# EAGLE design strobocops_v3 (EAGLE 8.7.1)
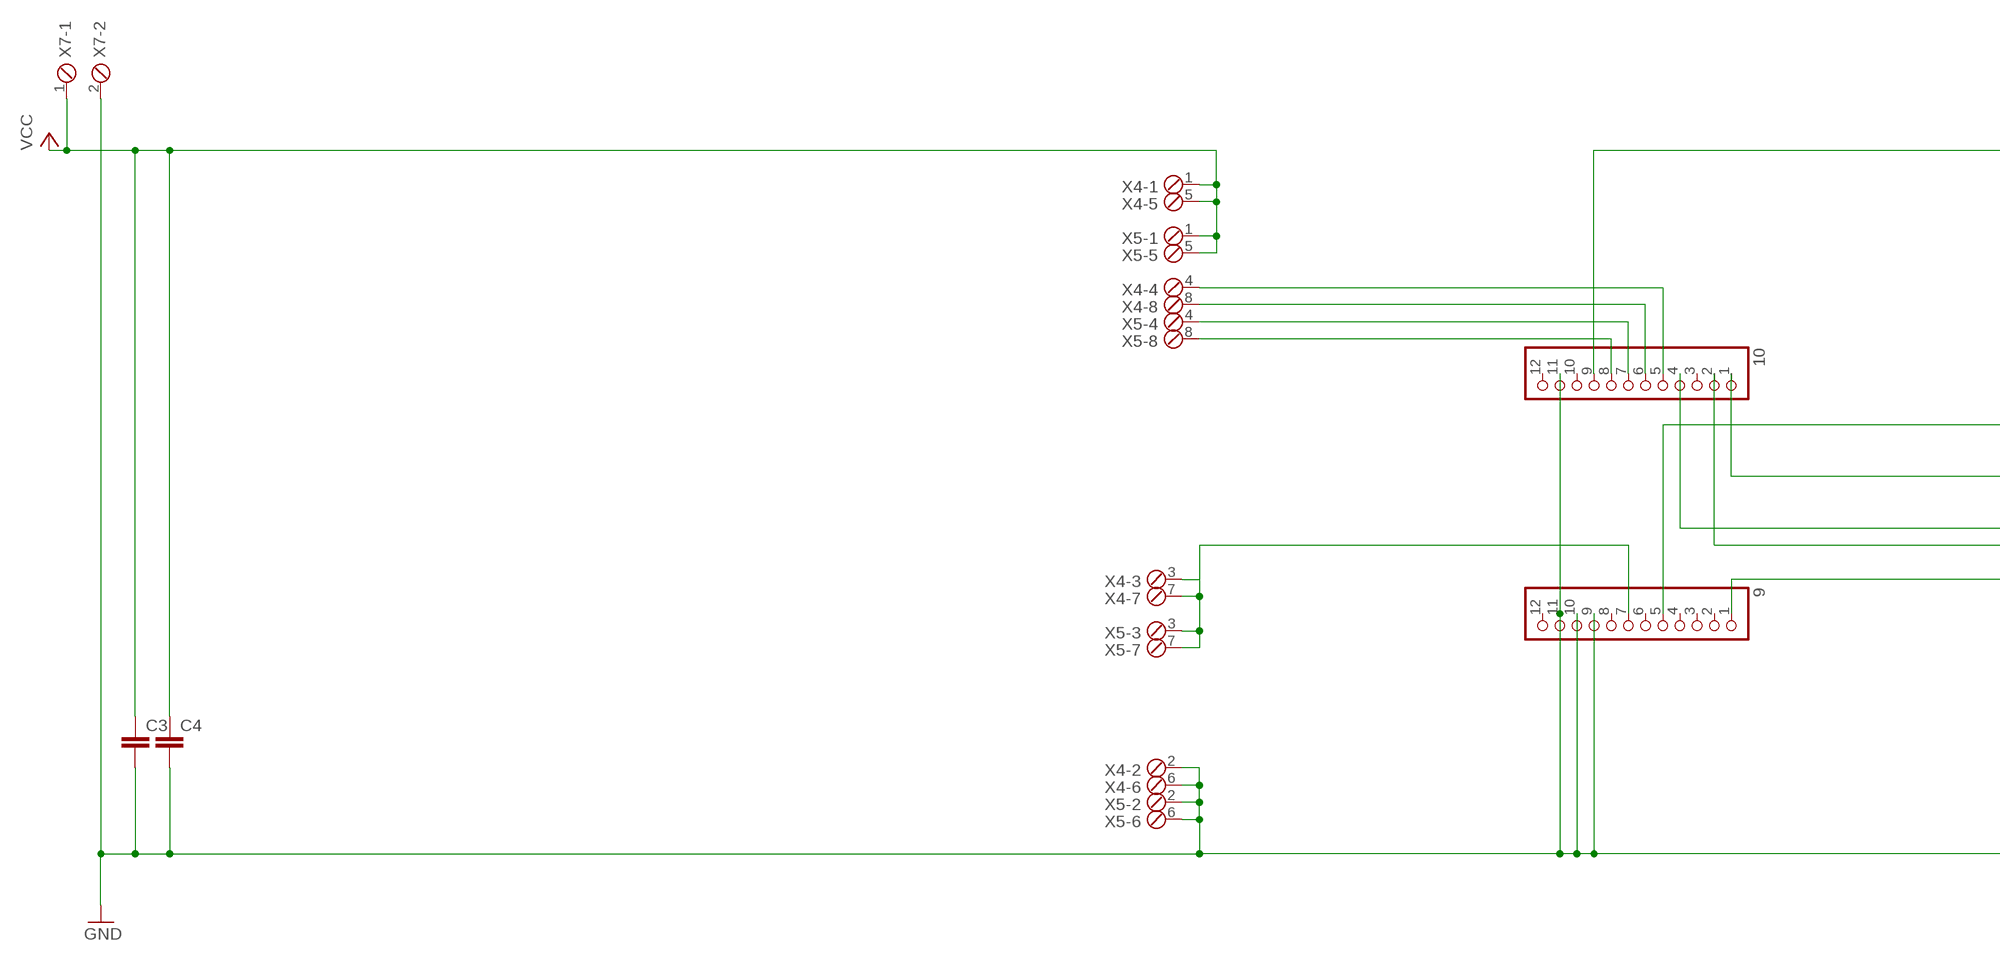
[diagram p0: schematic, sheet 1, part 1 of 2]
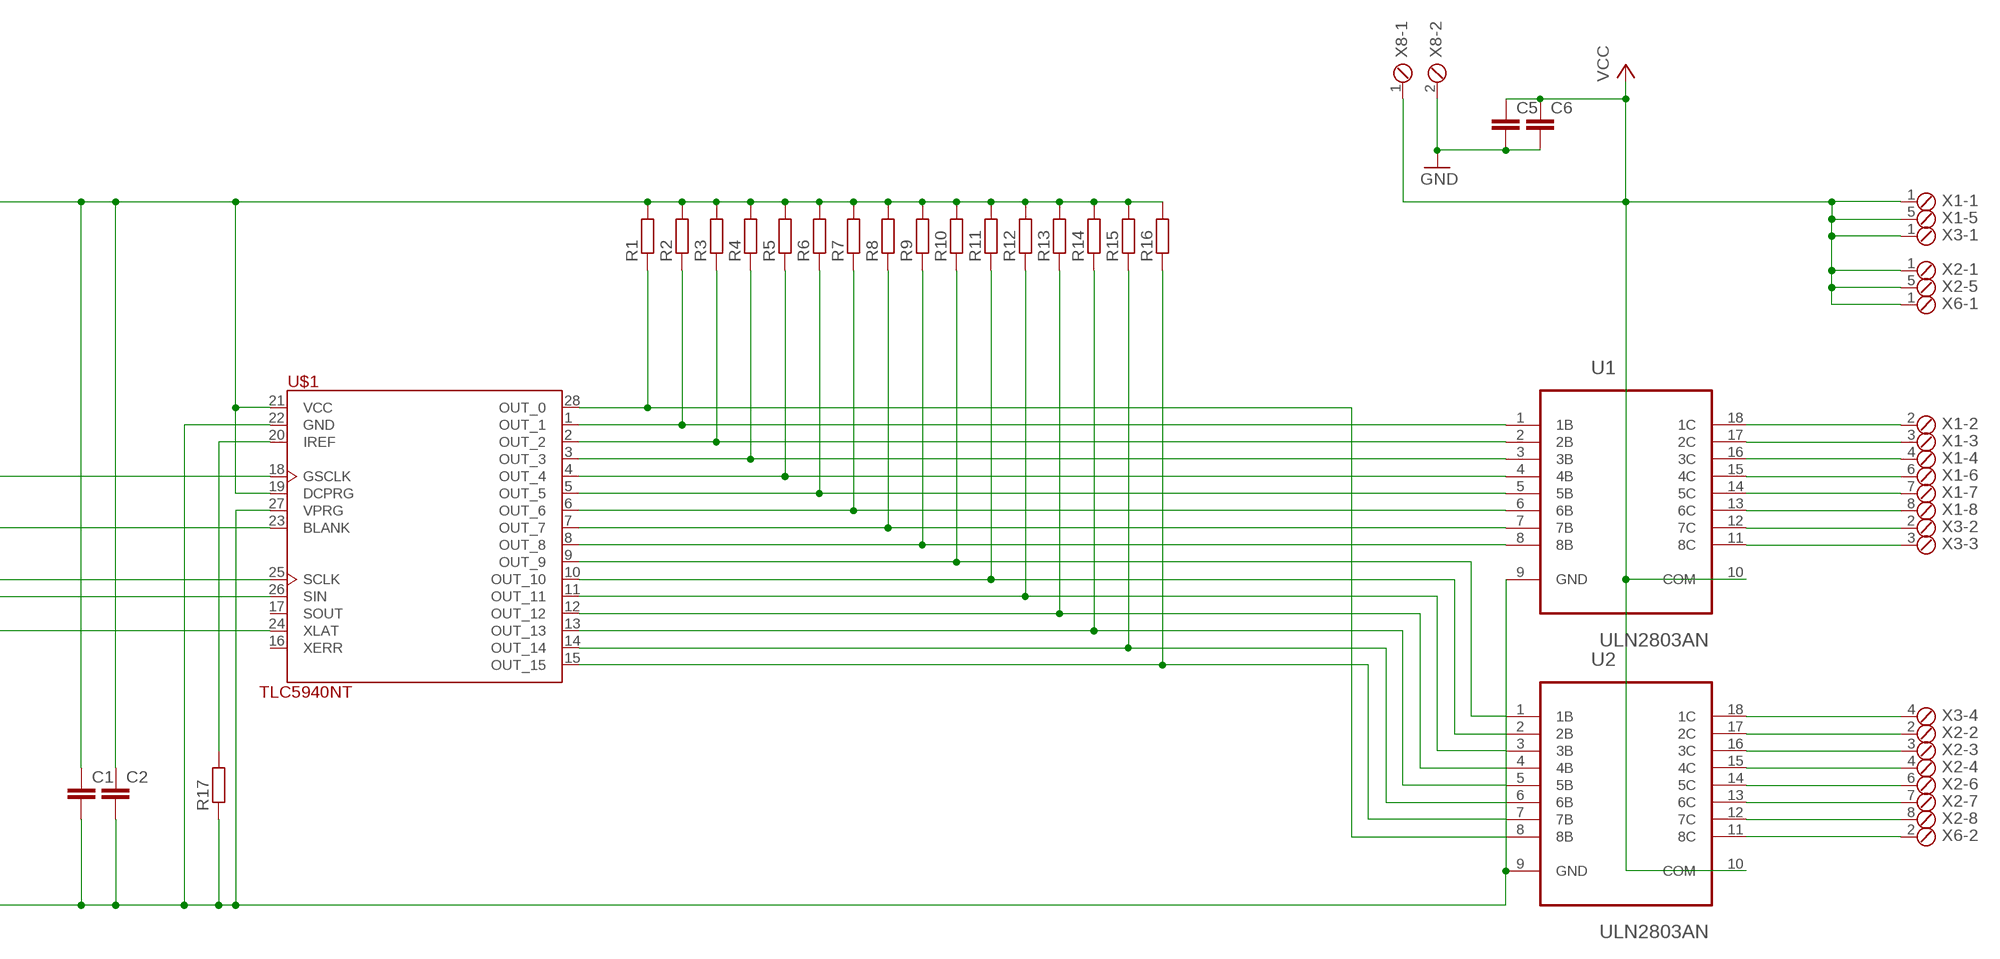
[diagram p1: schematic, sheet 1, part 2 of 2]

## Parts
9  PINHD-1X12-CB  [1X12-CB]
10  PINHD-1X12-CB  [1X12-CB]
C1  C-EU050-025X075  [C050-025X075]
C2  C-EU050-025X075  [C050-025X075]
C3  C-EU050-025X075  [C050-025X075]
C4  C-EU050-025X075  [C050-025X075]
C5  C-EU050-025X075  [C050-025X075]
C6  C-EU050-025X075  [C050-025X075]
R1  R-EU_0207/2V  [0207/2V]
R2  R-EU_0207/2V  [0207/2V]
R3  R-EU_0207/2V  [0207/2V]
R4  R-EU_0207/2V  [0207/2V]
R5  R-EU_0207/2V  [0207/2V]
R6  R-EU_0207/2V  [0207/2V]
R7  R-EU_0207/2V  [0207/2V]
R8  R-EU_0207/2V  [0207/2V]
R9  R-EU_0207/2V  [0207/2V]
R10  R-EU_0207/2V  [0207/2V]
R11  R-EU_0207/2V  [0207/2V]
R12  R-EU_0207/2V  [0207/2V]
R13  R-EU_0207/2V  [0207/2V]
R14  R-EU_0207/2V  [0207/2V]
R15  R-EU_0207/2V  [0207/2V]
R16  R-EU_0207/2V  [0207/2V]
R17  R-EU_0207/2V  [0207/2V]
U1  ULN2803AN  [DIP254P762X393-18]
U2  ULN2803AN  [DIP254P762X393-18]
U$1  TLC5940NT  [DIP-28]
X1  MPT8  [8POL254]
X2  MPT8  [8POL254]
X3  MPT4  [4POL254]
X4  MPT8  [8POL254]
X5  MPT8  [8POL254]
X6  MPT2  [2POL254]
X7  MPT2  [2POL254]
X8  MPT2  [2POL254]

## Nets
GND: 9.9 9.10 9.11 10.11 C1.2 C2.2 C3.2 C4.2 C5.2 C6.2 R17.1 U1.9(GND) U2.9(GND) U$1.22(GND) U$1.27(VPRG) X4.2 X4.6 X5.2 X5.6 X7.2 X8.2
N$1: 10.2 U$1.26(SIN)
N$2: 9.5 U$1.18(GSCLK)
N$3: 9.1 U$1.24(XLAT)
N$4: 10.1 U$1.23(BLANK)
N$5: 10.5 X4.4
N$6: R2.1 U1.1(1B) U$1.1(OUT_1)
N$7: R3.1 U1.2(2B) U$1.2(OUT_2)
N$8: R4.1 U1.3(3B) U$1.3(OUT_3)
N$9: R5.1 U1.4(4B) U$1.4(OUT_4)
N$10: R6.1 U1.5(5B) U$1.5(OUT_5)
N$11: R7.1 U1.6(6B) U$1.6(OUT_6)
N$12: R8.1 U1.7(7B) U$1.7(OUT_7)
N$13: R9.1 U1.8(8B) U$1.8(OUT_8)
N$14: U1.14(5C) X1.7
N$15: U1.18(1C) X1.2
N$16: U1.17(2C) X1.3
N$17: U1.16(3C) X1.4
N$18: U1.15(4C) X1.6
N$19: U1.13(6C) X1.8
N$20: U1.12(7C) X3.2
N$21: U1.11(8C) X3.3
N$22: U2.18(1C) X3.4
N$23: R14.1 U2.5(5B) U$1.13(OUT_13)
N$24: U2.17(2C) X2.2
N$25: U2.16(3C) X2.3
N$26: U2.15(4C) X2.4
N$27: U2.14(5C) X2.6
N$28: U2.13(6C) X2.7
N$29: U2.12(7C) X2.8
N$30: R10.1 U2.1(1B) U$1.9(OUT_9)
N$31: R11.1 U2.2(2B) U$1.10(OUT_10)
N$32: R12.1 U2.3(3B) U$1.11(OUT_11)
N$33: R13.1 U2.4(4B) U$1.12(OUT_12)
N$34: R15.1 U2.6(6B) U$1.14(OUT_14)
N$35: R16.1 U2.7(7B) U$1.15(OUT_15)
N$36: 9.7 X4.3 X4.7 X5.3 X5.7
N$37: 10.6 X4.8
N$38: 10.7 X5.4
N$39: U2.11(8C) X6.2
N$40: 10.8 X5.8
N$41: R17.2 U$1.20(IREF)
N$42: R1.1 U2.8(8B) U$1.28(OUT_0)
N$43: 10.4 U$1.25(SCLK)
VCC: C3.1 C4.1 X4.1 X4.5 X5.1 X5.5 X7.1
VCC_5V: 10.9 C1.1 C2.1 R1.2 R2.2 R3.2 R4.2 R5.2 R6.2 R7.2 R8.2 R9.2 R10.2 R11.2 R12.2 R13.2 R14.2 R15.2 R16.2 U$1.19(DCPRG) U$1.21(VCC)
VCC_12V: C5.1 C6.1 U1.10(COM) U2.10(COM) X1.1 X1.5 X2.1 X2.5 X3.1 X6.1 X8.1 ; supply symbol labelled VCC
Unconnected: 9.2 9.3 9.4 9.6 9.8 9.12 10.3 10.10 10.12 U$1.16(XERR) U$1.17(SOUT)

## Library data of the parts
9 10 = adafruit:PINHD-1X12: PIN HEADER
C1-C6 = resistor:C-EU: CAPACITOR, European symbol
R1-R17 = resistor:R-EU_: RESISTOR, European symbol
U1 U2 = ULN2803A:ULN2803AN: Darlington transistor array; MPN: ULN2803AN; OC_FARNELL: 1652422; OC_NEWARK: 21J9298; PACKAGE: DIP-18; SUPPLIER: TEXAS INSTRUMENTS
U$1 = tlc5940:TLC5940
X1 X2 X4 X5 = con-phoenix-254:MPT8: PHOENIX CONNECTOR; OC_FARNELL: unknown; OC_NEWARK: unknown
X3 = con-phoenix-254:MPT4: PHOENIX CONNECTOR; OC_FARNELL: unknown; OC_NEWARK: unknown
X6-X8 = con-phoenix-254:MPT2: PHOENIX CONNECTOR; OC_FARNELL: unknown; OC_NEWARK: unknown

## Board
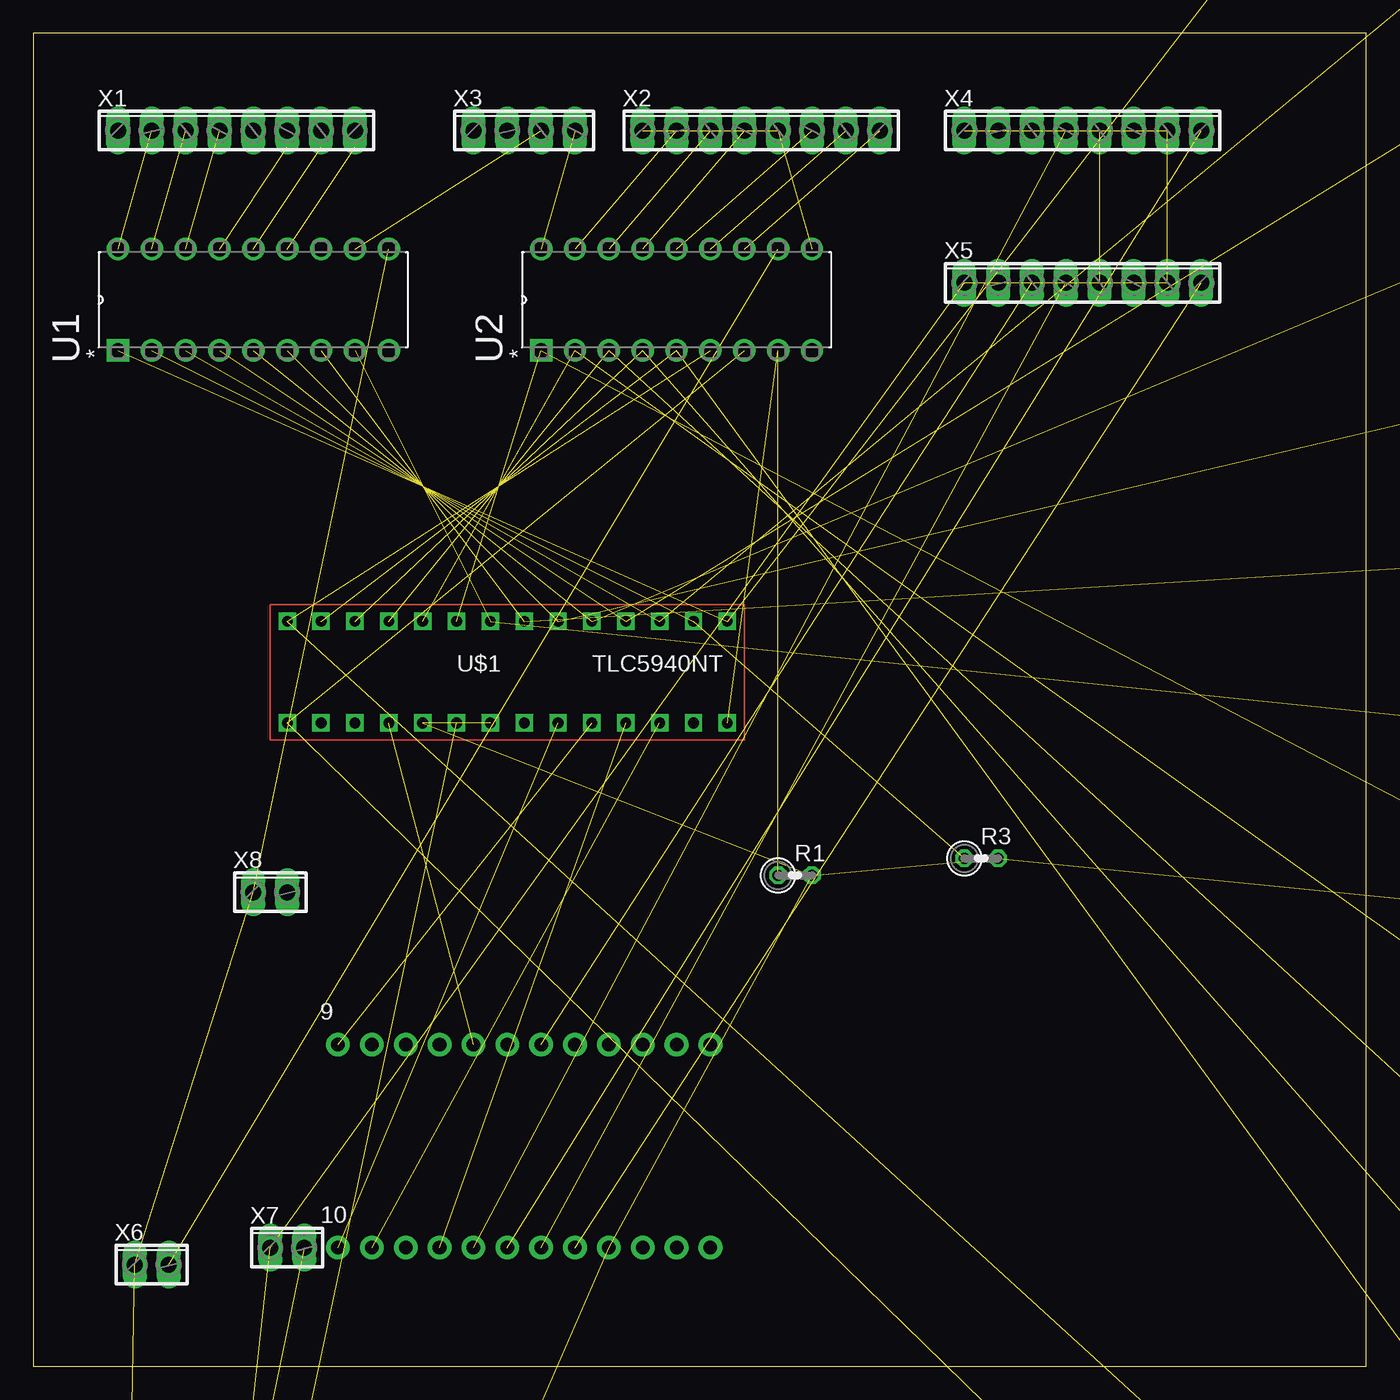
[diagram p2: board, top side]
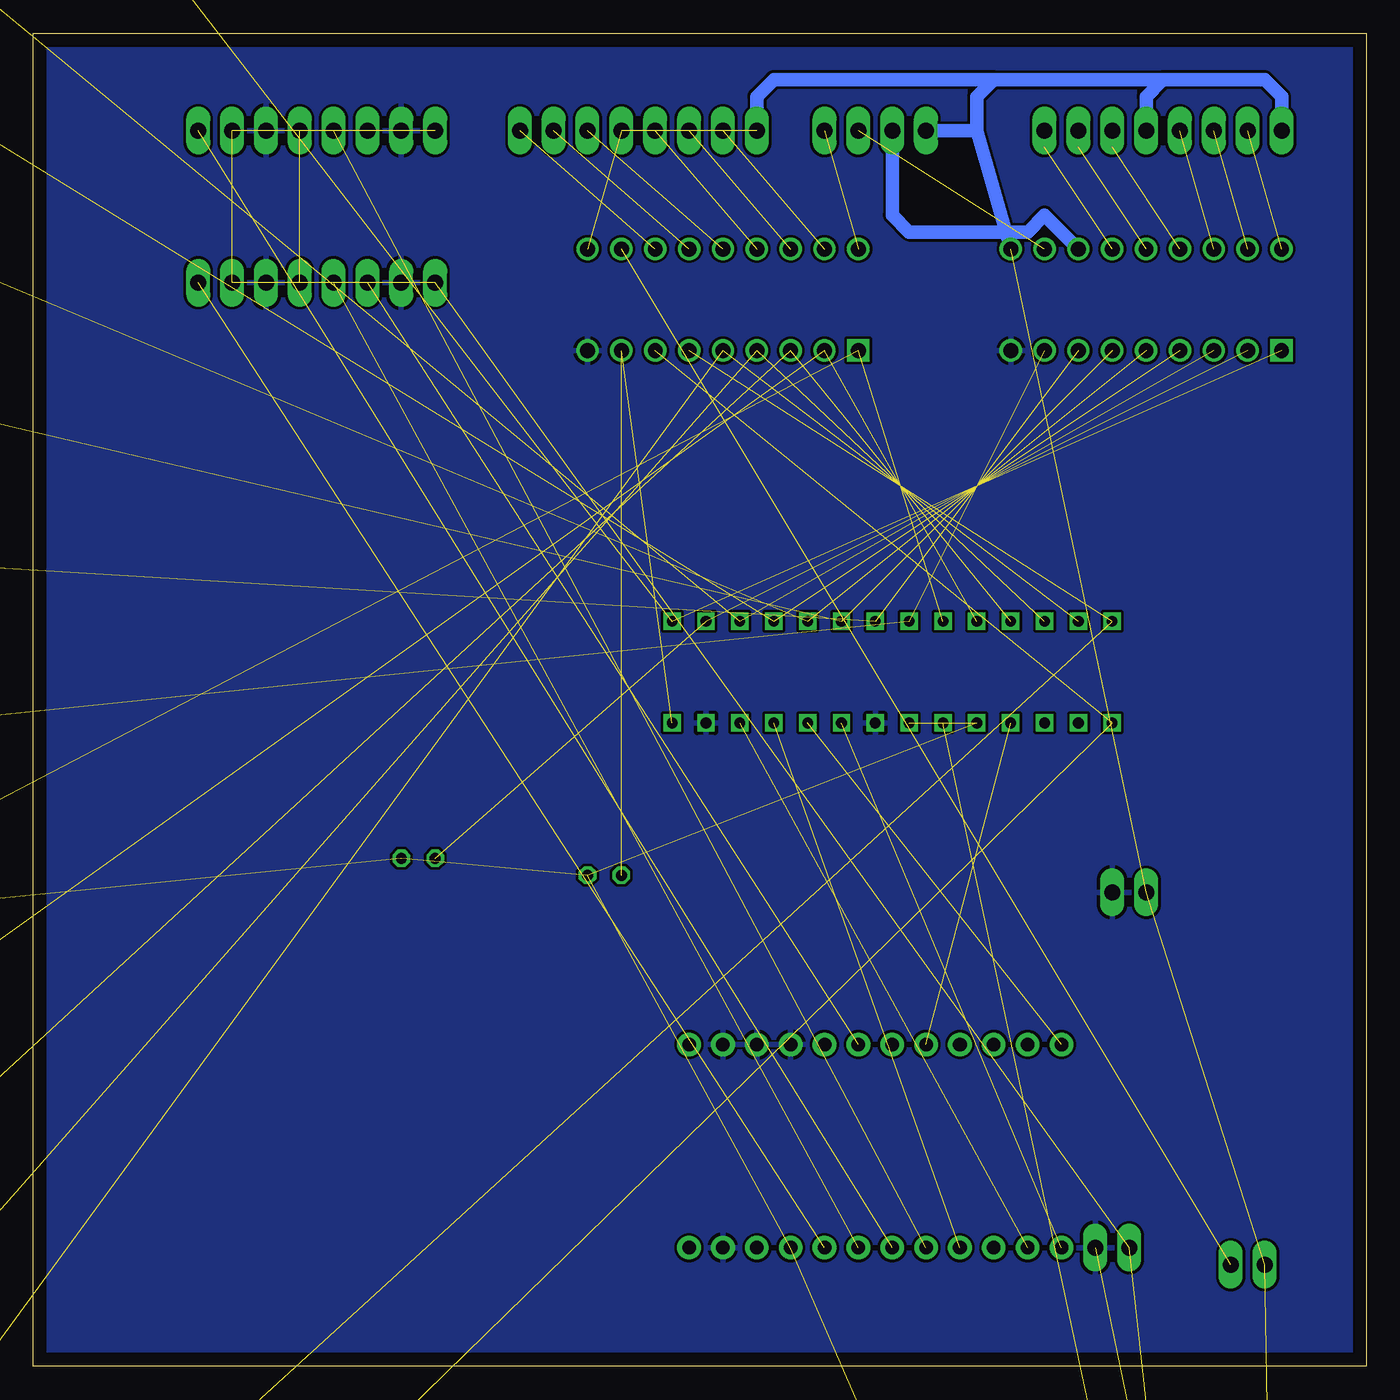
[diagram p3: board, bottom side, seen from below]

Size 100 x 100 mm. Coordinates in mm from the lower left corner, seen from the top.
Outline: 0,0 100,0 100,100 0,100 0,0
Copper layers (1*16): Top 0.035mm / dielectric 1.5mm / Bottom 0.035mm
Design rules "default": minimum track width 10mil, minimum drill 24mil, track to track 8mil, track to pad 8mil, pad to pad 8mil, via to via 8mil, smd to smd 8mil, copper to edge 40mil, drill to drill 8mil, minimum pad ring 10mil, minimum via ring 8mil, stop-mask expansion 4mil, vias tented up to drill 0mil, thermal gap 10mil

### Footprints (pad centres in the part's own frame; a part is rotated, then mirrored left to right if it is on the bottom)
1X12-CB = drill 1.016 pad 1.778: 1 -13.97,0; 2 -11.43,0; 3 -8.89,0; 4 -6.35,0; 5 -3.81,0; 6 -1.27,0; 7 1.27,0; 8 3.81,0; 9 6.35,0; 10 8.89,0; 11 11.43,0; 12 13.97,0
C050-025X075 = drill 0.813 octagon: 1 -2.54,0; 2 2.54,0
0207/2V = drill 0.813 octagon: 1 -1.27,0; 2 1.27,0
DIP254P762X393-18 = drill 1.118 square: 1 -7.62,20.32 | drill 1.118: 2 -7.62,17.78; 3 -7.62,15.24; 4 -7.62,12.7; 5 -7.62,10.16; 6 -7.62,7.62; 7 -7.62,5.08; 8 -7.62,2.54; 9 -7.62,0; 10 0,0; 11 0,2.54; 12 0,5.08; 13 0,7.62; 14 0,10.16; 15 0,12.7; 16 0,15.24; 17 0,17.78; 18 0,20.32
DIP-28 = drill 0.8 square: 1 -3.81,-1.27; 2 -3.81,-3.81; 3 -3.81,-6.35; 4 -3.81,-8.89; 5 -3.81,-11.43; 6 -3.81,-13.97; 7 -3.81,-16.51; 8 -3.81,-19.05; 9 -3.81,-21.59; 10 -3.81,-24.13; 11 -3.81,-26.67; 12 -3.81,-29.21; 13 -3.81,-31.75; 14 -3.81,-34.29; 15 3.81,-34.29; 16 3.81,-31.75; 17 3.81,-29.21; 18 3.81,-26.67; 19 3.81,-24.13; 20 3.81,-21.59; 21 3.81,-19.05; 22 3.81,-16.51; 23 3.81,-13.97; 24 3.81,-11.43; 25 3.81,-8.89; 26 3.81,-6.35; 27 3.81,-3.81; 28 3.81,-1.27
8POL254 = drill 1.2 long: 1 -8.89,0; 2 -6.35,0; 3 -3.81,0; 4 -1.27,0; 5 1.27,0; 6 3.81,0; 7 6.35,0; 8 8.89,0
4POL254 = drill 1.2 long: 1 -3.81,0; 2 -1.27,0; 3 1.27,0; 4 3.81,0
2POL254 = drill 1.2 long: 1 -1.27,0; 2 1.27,0

### Placement (x,y rotation side)
9  36.83,24.13 0 top
10  36.83,8.89 0 top
C1  7.62,-78.74 0 top  (outside the outline)
C2  7.62,-92.71 0 top  (outside the outline)
C3  7.62,-106.68 0 top  (outside the outline)
C4  7.62,-120.65 0 top  (outside the outline)
C5  7.62,-134.62 0 top  (outside the outline)
C6  7.62,-148.59 0 top  (outside the outline)
R1  57.15,36.83 0 top
R2  121.92,144.78 0 top  (outside the outline)
R3  71.12,38.1 0 top
R4  121.92,116.84 0 top  (outside the outline)
R5  121.92,102.87 0 top  (outside the outline)
R6  121.92,88.9 0 top  (outside the outline)
R7  121.92,74.93 0 top  (outside the outline)
R8  121.92,60.96 0 top  (outside the outline)
R9  121.92,46.99 0 top  (outside the outline)
R10  121.92,33.02 0 top  (outside the outline)
R11  121.92,19.05 0 top  (outside the outline)
R12  121.92,5.08 0 top  (outside the outline)
R13  121.92,-8.89 0 top  (outside the outline)
R14  121.92,-22.86 0 top  (outside the outline)
R15  121.92,-36.83 0 top  (outside the outline)
R16  121.92,-50.8 0 top  (outside the outline)
R17  6.35,-64.77 0 top  (outside the outline)
U1  26.67,83.82 90 top
U2  58.42,83.82 90 top
U$1  53.34,52.07 270 top
X1  15.24,92.71 0 top
X2  54.61,92.71 0 top
X3  36.83,92.71 0 top
X4  78.74,92.71 0 top
X5  78.74,81.28 0 top
X6  8.89,7.62 0 top
X7  19.05,8.89 0 top
X8  17.78,35.56 0 top

### Tracks (layer width: path | path; a pad name or v marks a point on that pad's centre or on a via)
GND  (7 unrouted)
  pour Bottom: 0,0 0,100.33 100.33,100.33 100.33,0
N$1  (1 unrouted)
N$2  (1 unrouted)
N$3  (1 unrouted)
N$4  (1 unrouted)
N$5  (1 unrouted)
N$6  (2 unrouted)
N$7  (2 unrouted)
N$8  (2 unrouted)
N$9  (2 unrouted)
N$10  (2 unrouted)
N$11  (2 unrouted)
N$12  (2 unrouted)
N$13  (2 unrouted)
N$14  (1 unrouted)
  Bottom 1.016: 21.59,91.44 X1.7
N$15  (1 unrouted)
N$16  (1 unrouted)
N$17  (1 unrouted)
N$18  (1 unrouted)
  Bottom 1.016: 19.05,91.44 X1.6
N$19  (1 unrouted)
  Bottom 1.016: 24.13,91.44 X1.8
N$20
  Bottom 1.016: X3.2 35.56,86.36 34.29,85.09 25.4,85.09 24.13,86.36 U1.12
N$21  (1 unrouted)
N$22  (1 unrouted)
N$23  (2 unrouted)
N$24  (1 unrouted)
N$25  (1 unrouted)
N$26  (1 unrouted)
N$27  (1 unrouted)
N$28  (1 unrouted)
N$29  (1 unrouted)
N$30  (2 unrouted)
N$31  (2 unrouted)
N$32  (2 unrouted)
N$33  (2 unrouted)
N$34  (2 unrouted)
N$35  (2 unrouted)
N$36  (4 unrouted)
N$37  (1 unrouted)
N$38  (1 unrouted)
N$39  (1 unrouted)
N$40  (1 unrouted)
N$41  (1 unrouted)
N$42  (2 unrouted)
N$43  (1 unrouted)
VCC  (6 unrouted)
VCC_5V  (20 unrouted)
VCC_12V  (6 unrouted)
  Bottom 1.016: X1.1 6.35,95.25 7.62,96.52 15.24,96.52 | 15.24,96.52 16.51,95.25 X1.5 | U1.10 29.21,92.71 | 29.21,92.71 29.21,95.25 27.94,96.52 | 27.94,96.52 15.24,96.52 | X2.1 45.72,95.25 44.45,96.52 27.94,96.52 | X3.1 29.21,92.71